# Altium schematic sheet PowerSupply.SchDoc
size A4; CompanyName: Technische Hochschule Nürnberg Georg Simon Ohm; Organization: UltraZohm; Address1: Kesslerplatz 12; Address2: 90489 Nürnberg; Address3: GERMANY; DocumentNumber: 2; SheetNumber: 2; SheetTotal: 2; Website: www.ultrazohm.com
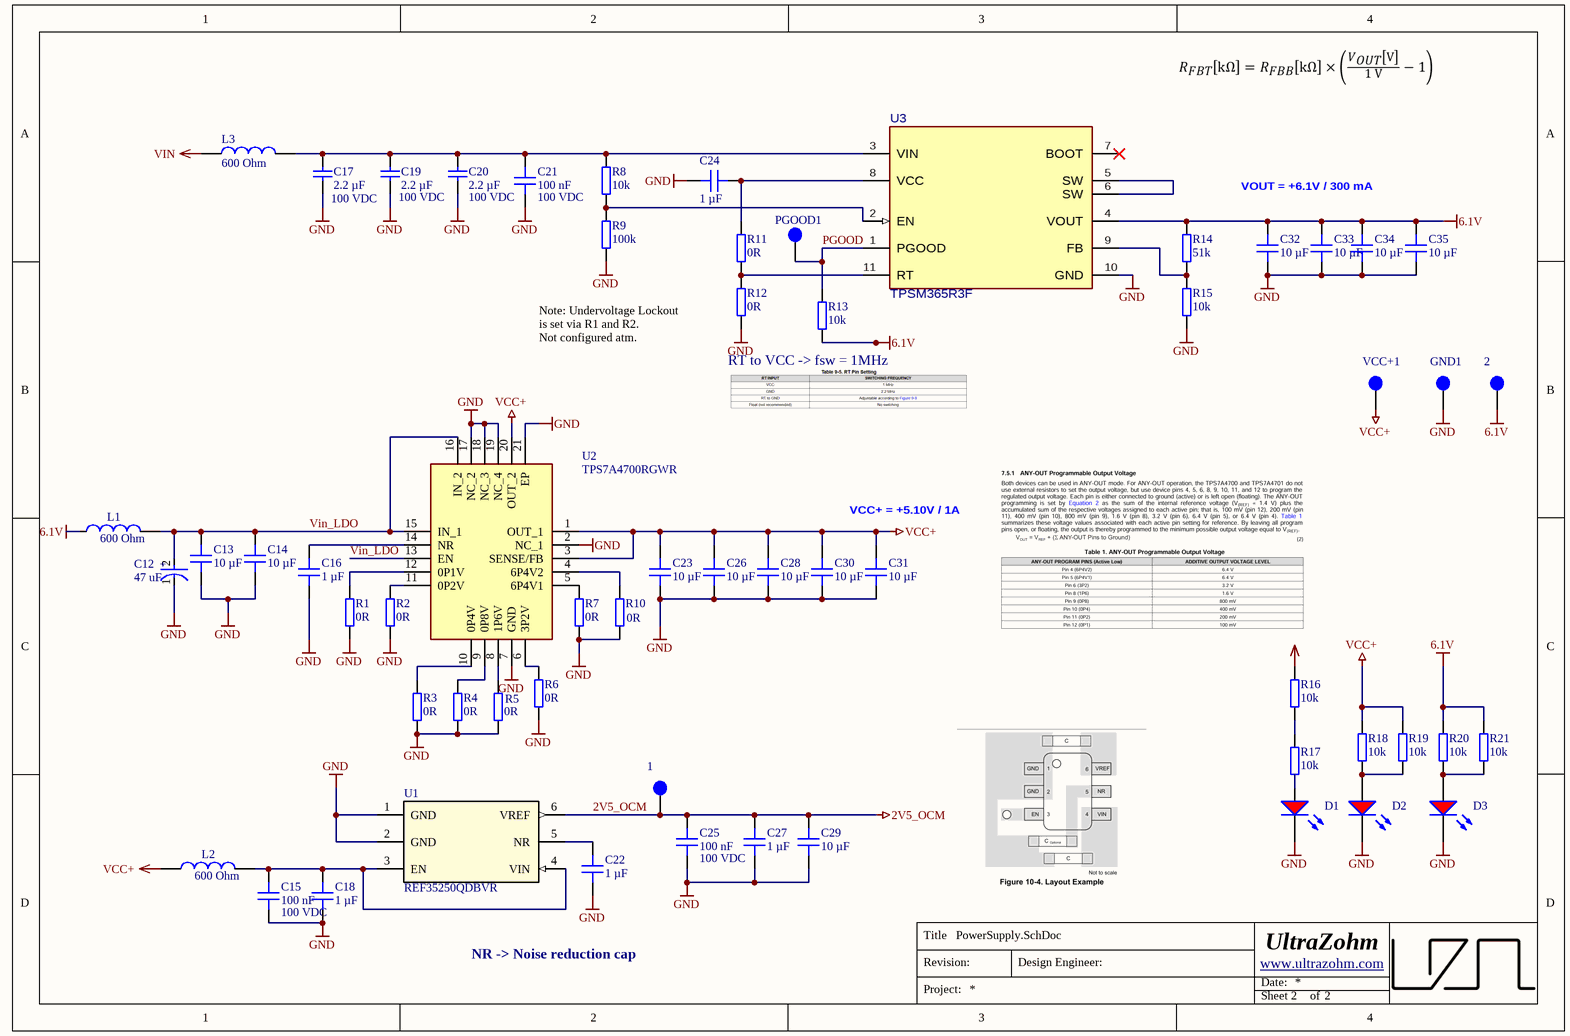
[diagram p0: PowerSupply.SchDoc]

## Parts
1  2V5  [TP_1mm]  (value not drawn)  (no BOM)
2  6.1V  [TP_1mm]  (value not drawn)  (no BOM)
C12  47 uF  [10TPE47MAZB]
C13  10 µF  [C0805]
C14  10 µF  [C0805]
C15  100 nF  Voltage Rating: 100 VDC  [C_0603]
C16  1 µF  [C_0603]
C17  2.2 µF  Voltage Rating: 100 VDC  [C_1210_TE]
C18  1 µF  [C_0603]
C19  2.2 µF  Voltage Rating: 100 VDC  [C_1210_TE]
C20  2.2 µF  Voltage Rating: 100 VDC  [C_1210_TE]
C21  100 nF  Voltage Rating: 100 VDC  [C_0603]
C22  1 µF  [C_0603]
C23  10 µF  [C0805]
C24  1 µF  [C_0603]
C25  100 nF  Voltage Rating: 100 VDC  [C_0603]
C26  10 µF  [C0805]
C27  1 µF  [C_0603]
C28  10 µF  [C0805]
C29  10 µF  [C0805]
C30  10 µF  [C0805]
C31  10 µF  [C0805]
C32  10 µF  [C0805]
C33  10 µF  [C0805]
C34  10 µF  [C0805]
C35  10 µF  [C0805]
D1  KT-0603R  [WL-SMCW_0603]  (value not drawn)
D2  KT-0603R  [WL-SMCW_0603]  (value not drawn)
D3  KT-0603R  [WL-SMCW_0603]  (value not drawn)
GND1  Testpoint 1mm  [TP_1mm]  (value not drawn)  (no BOM)
L1  600 Ohm  [WE-CBF_0805_High Current]
L2  600 Ohm  [WE-CBF_0805_High Current]
L3  600 Ohm  [WE-CBF_0805_High Current]
PGOOD1  Testpoint 1mm  [TP_1mm]  (value not drawn)  (no BOM)
R1  0R  [RES 0603_1608]
R2  0R  [RES 0603_1608]
R3  0R  [RES 0603_1608]
R4  0R  [RES 0603_1608]
R5  0R  [RES 0603_1608]
R6  0R  [RES 0603_1608]
R7  0R  [RES 0603_1608]
R8  10k  [RES 0603_1608]
R9  100k  [RES 0603_1608]
R10  0R  [RES 0603_1608]
R11  0R  [RES 0603_1608]
R12  0R  [RES 0603_1608]
R13  10k  [RES 0603_1608]
R14  51k  [R_0603_TE]
R15  10k  [RES 0603_1608]
R16  10k  [RES 0603_1608]
R17  10k  [RES 0603_1608]
R18  10k  [RES 0603_1608]
R19  10k  [RES 0603_1608]
R20  10k  [RES 0603_1608]
R21  10k  [RES 0603_1608]
U1  REF35250QDBVR  [TI_SOT23_6-Leads]
U2  TPS7A4700RGWR  [QFN65P500X500X100-21N-D]
U3  TPSM365R3F  [RDN0011A-MFG]
VCC+1  VCC+  [TP_1mm]  (value not drawn)  (no BOM)

## Nets
2V5_OCM: 1.1 C25.2 C27.2 C29.2 U1.6(VREF)
6.1V: 2.1 C32.2 C33.2 C34.2 C35.2 L1.1 R13.2 R14.2 R20.1 R21.1 U3.4(VOUT)
GND: C12.1(C) C13.1 C14.1 C15.1 C16.2 C17.2 C18.1 C19.2 C20.2 C21.1 C22.1 C23.1 C24.2 C25.1 C26.1 C27.1 C28.1 C29.1 C30.1 C31.1 C32.1 C33.1 C34.1 C35.1 D1.1(K) D2.1(K) D3.1(K) GND1.1 R1.2 R2.1 R3.1 R4.1 R5.1 R6.2 R7.1 R9.2 R10.1 R12.1 R15.2 U1.1(GND) U1.2(GND) U2.2(NC_1) U2.7(GND) U2.17(NC_2) U2.18(NC_3) U2.19(NC_4) U2.21(EP) U3.10(GND)
VCC+: C23.2 C26.2 C28.2 C30.2 C31.2 L2.1 R18.1 R19.1 U2.1(OUT_1) U2.3(SENSE/FB) U2.20(OUT_2) VCC+1.1
VIN: L3.1 R16.1
PGOOD: PGOOD1.1 R13.1 U3.1(PGOOD)
Vin_LDO: C12.2(A) C13.2 C14.2 L1.2 U2.13(EN) U2.15(IN_1) U2.16(IN_2)
NetC15_2: C15.2 C18.2 L2.2 U1.3(EN) U1.4(VIN)
NetC16_1: C16.1 U2.14(NR)
NetC17_1: C17.1 C19.1 C20.1 C21.2 L3.2 R8.2 U3.3(VIN)
NetC22_2: C22.2 U1.5(NR)
NetC24_1: C24.1 R11.2 U3.8(VCC)
NetD1_2: D1.2(A) R17.2
NetD2_2: D2.2(A) R18.2 R19.2
NetD3_2: D3.2(A) R20.2 R21.2
NetR1_1: R1.1 U2.12(0P1V)
NetR2_2: R2.2 U2.11(0P2V)
NetR3_2: R3.2 U2.10(0P4V)
NetR4_2: R4.2 U2.9(0P8V)
NetR5_2: R5.2 U2.8(1P6V)
NetR6_1: R6.1 U2.6(3P2V)
NetR7_2: R7.2 U2.5(6P4V1)
NetR8_1: R8.1 R9.1 U3.2(EN)
NetR10_2: R10.2 U2.4(6P4V2)
NetR11_1: R11.1 R12.2 U3.11(RT)
NetR14_1: R14.1 R15.1 U3.9(FB)
NetR16_2: R16.2 R17.1
NetU3_5: U3.5(SW) U3.6(SW)

Not connected (* = marked no-connect by the designer): U3 7(BOOT)*

## Notes on the sheet
- VOUT = +6.1V / 300 mA
- Note: Undervoltage Lockout is set via R1 and R2.
  Not configured atm.
- RT to VCC -> fsw = 1MHz
- VCC+ = +5.10V / 1A
- NR -> Noise reduction cap
- Title
- Revision:
- Design Engineer:
- Date:
- Project:
- Sheet
- of
- (in symbol 10TPE47MAZB) +

## Library data of the parts
1 2 VCC+1 = NULL: Testpoint 1mm; Manufacturer Part Number: NULL; Created from: AGeiger; Created: 2018_06_25_AGeiger; Value: Testpoint 1mm; PartID: 9; Created On: 20/09/2022 13:14:57; Component Type: Testpoint; Last Updated: 20/09/2022 13:15:39; Manufacturer: NULL; Supplier 1: NULL; Supplier Part Number 1: NULL; Type: Testpoint; Live Cycle Status: 1
C12 = 10TPE47MAZB: Tantalum Capacitors - Polymer 10volts 47uF ESR 35mohm; Manufacturer: Panasonic; Tolerance: 20 %; Voltage Rating: 10 VDC; Created from: Kilhan; Manufacturer Part Number: 10TPE47MAZB; PartID: 173; Created On: 26/06/2025 16:14:36; ComponentLink1Description: Datasheet; ComponentLink1URL: https://industrial.panasonic.com/cdbs/www-data/pdf/AAA8000/AAA8000C36.pdf; Component Type: Tantalum Capacitor; Device Package: 1210 (3528 metric); Last Updated: 26/06/2025 16:39:07; Mounting Type: SMD; Operating Temperature: -55 to +105°C; Series: TPE; Supplier 1: Mouser; Supplier Part Number 1: 667-10TPE47MAZB; Supplier 2: LCSC; Supplier Part Number 2: C147768; Type: Capacitor; Value: 47 uF; Live Cycle Status: 1; LCSC Part Number: C147768; Stock number: not stored
C13 C14 C23 C26 C28-C35 = GRM21BR6YA106KE43L: Capacitor 0805, 35 VDC, 10 µF, X5R; Manufacturer: muRata; Tolerance: 10 %; Voltage Rating: 35 VDC; Created from: MGremer; Manufacturer Part Number: GRM21BR6YA106KE43L; PartID: 28; Created On: 20.12.2020 13:54:13; ComponentLink1Description: Datasheet; ComponentLink1URL: https://www.mouser.de/datasheet/2/281/murata_03052018_GRM_Series_1-1310166.pdf; Component Type: Capacitor 0805; Device Package: 0805; Last Updated: 20.12.2020 17:44:37; Mounting Type: SMD; Operating Temperature: -55 - 85°C; Series: GRM; Supplier 1: Mouser; Supplier Part Number 1: 81-GRM21BR6YA106KE3L; Type: Capacitor; Value: 10 µF; Live Cycle Status: 1; Stock number: Labor SMD Container; LCSC Part Number: C162422
C15 C21 C25 = C1608X7S2A104KT000N: 100V 100nF X7S ±10% 0603 Multilayer Ceramic Capacitors MLCC - SMD/SMT ROHS; Manufacturer: TDK; Created from: AGeiger; Manufacturer Part Number: C1608X7S2A104KT000N; PartID: 148; Created On: 20.12.2020 13:54:13; ComponentLink1Description: Datasheet; ComponentLink1URL: https://datasheet.lcsc.com/lcsc/2304140030_TDK-C1608X7S2A104KT000N_C343025.pdf; Component Type: Capacitor 0603; Device Package: 0603; Last Updated: 14.12.2022 12:14:21; Mounting Type: SMD; Operating Temperature: -55 to 125°C; Series: X7R; Supplier 1: LCSC; Supplier Part Number 1: C343025; Type: Capacitor; Tolerance: 10 %; Value: 100 nF; Live Cycle Status: 1; LCSC Part Number: C343025; Stock number: not stored
C16 C18 C22 C24 C27 = CL10A105KB8NNNC: 50V 1uF X5R ±10% 0603  Multilayer Ceramic Capacitors MLCC - SMD/SMT ROHS; Manufacturer: Samsung Electro-Mechanics; Voltage Rating: 50 VDC; Created from: MGremer; Manufacturer Part Number: CL10A105KB8NNNC; ComponentLink1Description: Datasheet; ComponentLink1URL: https://datasheet.lcsc.com/lcsc/1810261812_Samsung-Electro-Mechanics-CL10A105KB8NNNC_C15849.pdf; Component Type: Capacitor 0603; Device Package: 0603; Mounting Type: SMD; Operating Temperature: -55 - 85°C; Supplier 1: LCSC; Supplier Part Number 1: C15849; Type: Capacitor; Tolerance: 10 %; Value: 1 µF; Live Cycle Status: 1; Stock number: Labor SMD Container; LCSC Part Number: C15849; PartID: 5; Created On: 20/12/2020 13:54:13; Last Updated: 28/11/2022 17:23:01; Series: M
C17 C19 C20 = FS32X225K101EGG: 100V 2.2uF X7R ±10% 1210 Multilayer Ceramic Capacitors MLCC - SMD/SMT ROHS; Manufacturer: PSA(Prosperity Dielectrics); Created from: AGeiger; Manufacturer Part Number: FS32X225K101EGG; PartID: 170; Created On: 11.03.2025 16:22:30; ComponentLink1Description: Datasheet; ComponentLink1URL: https://www.lcsc.com/datasheet/lcsc_datasheet_2410121308_PSA-Prosperity-Dielectrics-FS32X225K101EGG_C153036.pdf; Component Type: Capacitor 1210; Device Package: 1210; Last Updated: 27.05.2025 19:11:48; Mounting Type: SMD; Operating Temperature: -55 to +125°C; Series: FS; Supplier 1: LCSC; Supplier Part Number 1: C153036; Type: Capacitor; Tolerance: 10%; Value: 2.2 µF; Live Cycle Status: 1; LCSC Part Number: C153036
D1-D3 = KT-0603R: LED RED 520~625NM 90~100MCD@20MA TOP VIEW 0603 ROHS; Manufacturer: Hubei KENTO Elec; Type: Standard; Created from: T. Wendt; Forward Current I_f: 20 mA; Forward Voltage U_f: 2.1 V; Wavelength: 620 nm; Light Intensity: 110 mcd; Nominal Power: 42 mW; Manufacturer Part Number: KT-0603R; PartID: 8; Created On: 03/03/2021 10:06:23; ComponentLink1Description: Datasheet; ComponentLink1URL: https://datasheet.lcsc.com/szlcsc/Hubei-KENTO-Elec-KT-0603R_C2286.pdf; Component Type: LED Diode; Device Package: 0603; Last Updated: 04/03/2021 09:02:49; Mounting Type: SMD; Operating Temperature: -40 - 85 °C; Supplier 1: LCSC; Supplier Part Number 1: C2286; Live Cycle Status: 1; Stock number: not stored; Color: red; LCSC Part Number: C2286
GND1 PGOOD1 = NULL: Manufacturer Part Number: NULL; Created from: AGeiger; Created: 2018_06_25_AGeiger; Value: Testpoint 1mm; PartID: 9; Component Type: Testpoint; Manufacturer: NULL; Supplier 1: NULL; Supplier Part Number 1: NULL; Type: Testpoint; Live Cycle Status: 1
  GND1: Created On: 20/09/2022 13:14:57; Last Updated: 20/09/2022 13:15:39
  PGOOD1: Created On: 20.09.2022 13:14:57; Last Updated: 20.09.2022 13:15:39
L1-L3 = 742792040: Inductance, 0805, 100 MHz, 600 Ohm, 2 A; Manufacturer: Wuerth Elektronik; Type: Inductance SMD; DC current: 2 A; Created from: AGeiger; ComponentLink1Description: Datasheet; ComponentLink1URL: https://www.mouser.de/datasheet/2/445/742792040-1720361.pdf; Value: 600 Ohm; Supplier 1: Mouser; Supplier Part Number 1: 710-742792040; LCSC Part Number: C2661857; Manufacturer Part Number: 742792040; PartID: 1; Created On: 18/01/2021 14:53:17; Component Type: Inductance; Device Package: 0805; Last Updated: 22/08/2024 07:43:45; Mounting Type: SMD; Operating Temperature: -55 - 125 °C; Series: WE-CBF; Live Cycle Status: 1; Stock number: not stored
R1-R7 R10-R12 = RC0603JR-070RL: SMD resistor E24 series; Manufacturer: YAGEO; Tolerance: 5%; Created from: MGremer; Manufacturer Part Number: RC0603JR-070RL; PartID: 1; Created On: 14/12/2020 16:17:14; ComponentLink1Description: Datasheet; ComponentLink1URL: https://www.mouser.de/datasheet/2/447/PYu-RC_Group_51_RoHS_L_10-1664068.pdf; Component Type: SMD resistor; Device Package: 0603; Last Updated: 04/03/2021 09:09:42; Mounting Type: SMD; Supplier 1: Mouser; Supplier Part Number 1: 603-RC0603JR-070RL; Supplier 2: LCSC; Supplier Part Number 2: C21189; Type: Resistor; Value: 0R; Live Cycle Status: 1; Stock number: Labor SMD Container; LCSC Part Number: C21189
R8 R13 R15-R21 = 0603WAF1002T5E: SMD resistor 1%; Manufacturer: UNI-ROYAL; Created from: AGeiger; Manufacturer Part Number: 0603WAF1002T5E; PartID: 265; Created On: 01/06/2023 06:49:29; Value: 10k; Device Package: 0603; Tolerance: 1%; Mounting Type: SMD; Last Updated: 01/06/2023 06:49:29; ComponentLink1Description: Datasheet; ComponentLink1URL: https://datasheet.lcsc.com/lcsc/2206010045_UNI-ROYAL-Uniroyal-Elec-0603WAF1002T5E_C25804.pdf; Component Type: SMD resistor; Supplier 1: LCSC; Supplier Part Number 1: C25804; Type: Resistor; Live Cycle Status: 1; LCSC Part Number: C25804
R9 = CRCW0603100KFKEAC: SMD resistor 1%; Manufacturer: Vishay; Created from: MGremer; Manufacturer Part Number: CRCW0603100KFKEAC; PartID: 181; Created On: 14/12/2020 16:17:14; Value: 100k; Device Package: 0603; Tolerance: 1%; Mounting Type: SMD; Last Updated: 21/05/2021 10:03:40; ComponentLink1Description: Datasheet; ComponentLink1URL: https://www.mouser.de/datasheet/2/427/crcwce3-1762584.pdf; Component Type: SMD resistor; Supplier 1: Mouser; Supplier Part Number 1: 71-CRCW0603100KFKEAC; Type: Resistor; Live Cycle Status: 1; Stock number: not stored
R14 = 0603WAF5102T5E: 100mW Thick Film Resistors 75V ±100ppm/℃ ±1% 51kΩ 0603 Chip Resistor - Surface Mount ROHS; Manufacturer: UNI-ROYAL(Uniroyal Elec); Created from: KIlhan; Manufacturer Part Number: 0603WAF5102T5E; PartID: 363; Created On: 16/06/2025 17:07:49; ComponentLink1Description: Datasheet; ComponentLink1URL: https://jlcpcb.com/api/file/downloadByFileSystemAccessId/8579706288655699968; Component Type: SMD resistor; Device Package: 0603; Last Updated: 18/06/2025 13:28:44; Mounting Type: SMD; Supplier 1: LCSC; Supplier Part Number 1: C23196; Type: Resistor; Tolerance: 1%; Value: 51k; Live Cycle Status: 1; Stock number: not stored; LCSC Part Number: C23196
U1 = REF35250QDBVR: 2.5V ±0.05% 2.75V~6V 10mA Fixed SOT-23-6 Voltage Reference ROHS; Manufacturer: Texas Instruments; Created from: KIlhan; Manufacturer Part Number: REF35250QDBVR; PartID: 18; Created On: 20/03/2025 09:42:36; ComponentLink1Description: Datasheet; ComponentLink1URL: https://wmsc.lcsc.com/wmsc/upload/file/pdf/v2/lcsc/2311301509_Texas-Instruments-REF35250QDBVR_C6265005.pdf; Component Type: Voltage Reference; Device Package: SMD; Last Updated: 23/03/2025 21:09:34; Mounting Type: SMD; Operating Temperature: -40℃~+125℃; Supplier 1: Mouser; Supplier Part Number 1: 595-REF35250QDBVR; Supplier 2: LCSC; Supplier Part Number 2: C6265005; Type: Voltage Reference; Value: 2.5V; Live Cycle Status: 1; LCSC Part Number: C6265005; Stock number: not stored
U2 = TPS7A4700RGWR: 1-A, 36-V, low-noise, high-PSRR, low-dropout voltage regulator with enable; Manufacturer_Name: Texas Instruments; Geometry.Height: 1mm; Value: 5 V; Created from: KIlhan; Manufacturer_Part_Number: TPS7A4701RGWR; Mouser Part Number: 595-TPS7A4701RGWR; Mouser Price/Stock: https://www.mouser.co.uk/ProductDetail/Texas-Instruments/TPS7A4701RGWR?qs=2YfbMANv382WBl7zEiZ0Og%3D%3D; Arrow Part Number: TPS7A4701RGWR; Arrow Price/Stock: https://www.arrow.com/en/products/tps7a4701rgwr/texas-instruments?utm_currency=USD&region=nac; Datasheet Link: http://www.ti.com/lit/gpn/tps7a47; Manufacturer Part Number: TPS7A4700RGWR; PartID: 20; Created On: 16/06/2025 23:37:46; ComponentLink1Description: Datasheet; ComponentLink1URL: https://www.ti.com/lit/ds/symlink/tps7a47.pdf?ts=1750053970117&ref_url=https%253A%252F%252Fwww.ti.com%252Fproduct%252FTPS7A47%253FkeyMatch%253DTPS7A4701RGWR%2526tisearch%253Duniversal_search%2526usecase%253DOPN-ALT; Component Type: LDO; Device Package: VQFN-20-EP(5x5); Last Updated: 18/06/2025 15:16:15; Manufacturer: Texas Instruments; Mounting Type: SMD; Operating Temperature: -40 to +125 °C; Series: TPS7A47; Supplier 1: Mouser; Supplier Part Number 1: 595-TPS7A4700RGWR; Supplier 2: LCSC; Supplier Part Number 2: C114839; Type: LDO; Live Cycle Status: 1; LCSC Part Number: C114839; Stock number: not stored
U3 = TPSM365R6FRDNR: 3-V to 65-V input, 1-V to 13-V output, 0.6-A synchronous buck converter power module; Manufacturer Part Number: TPSM365R3FRDNR; Manufacturer: Texas Instruments; Created from: KIlhan; PartID: 42; Created On: 16/06/2025 17:12:20; ComponentLink1Description: Datasheet; ComponentLink1URL: https://www.ti.com/lit/ds/symlink/tpsm365r3.pdf?ts=1747982141267; Component Type: Power module with inductor; Device Package: QFN-FCMOD; Last Updated: 16/06/2025 17:12:20; Mounting Type: SMD; Operating Temperature: -40 to +125 °C; Series: TPSM365; Supplier 1: LCSC; Supplier Part Number 1: C20346006; Type: Power module (integrated inductor); Value: TPSM365R3F; Live Cycle Status: 1; LCSC Part Number: C20346006; Stock number: not stored; Supplier 2: Mouser; Supplier Part Number 2: 595-TPSM365R6FRDNR